# EAGLE schematic SimpleKeyboardTeensy (EAGLE 7.7.0)
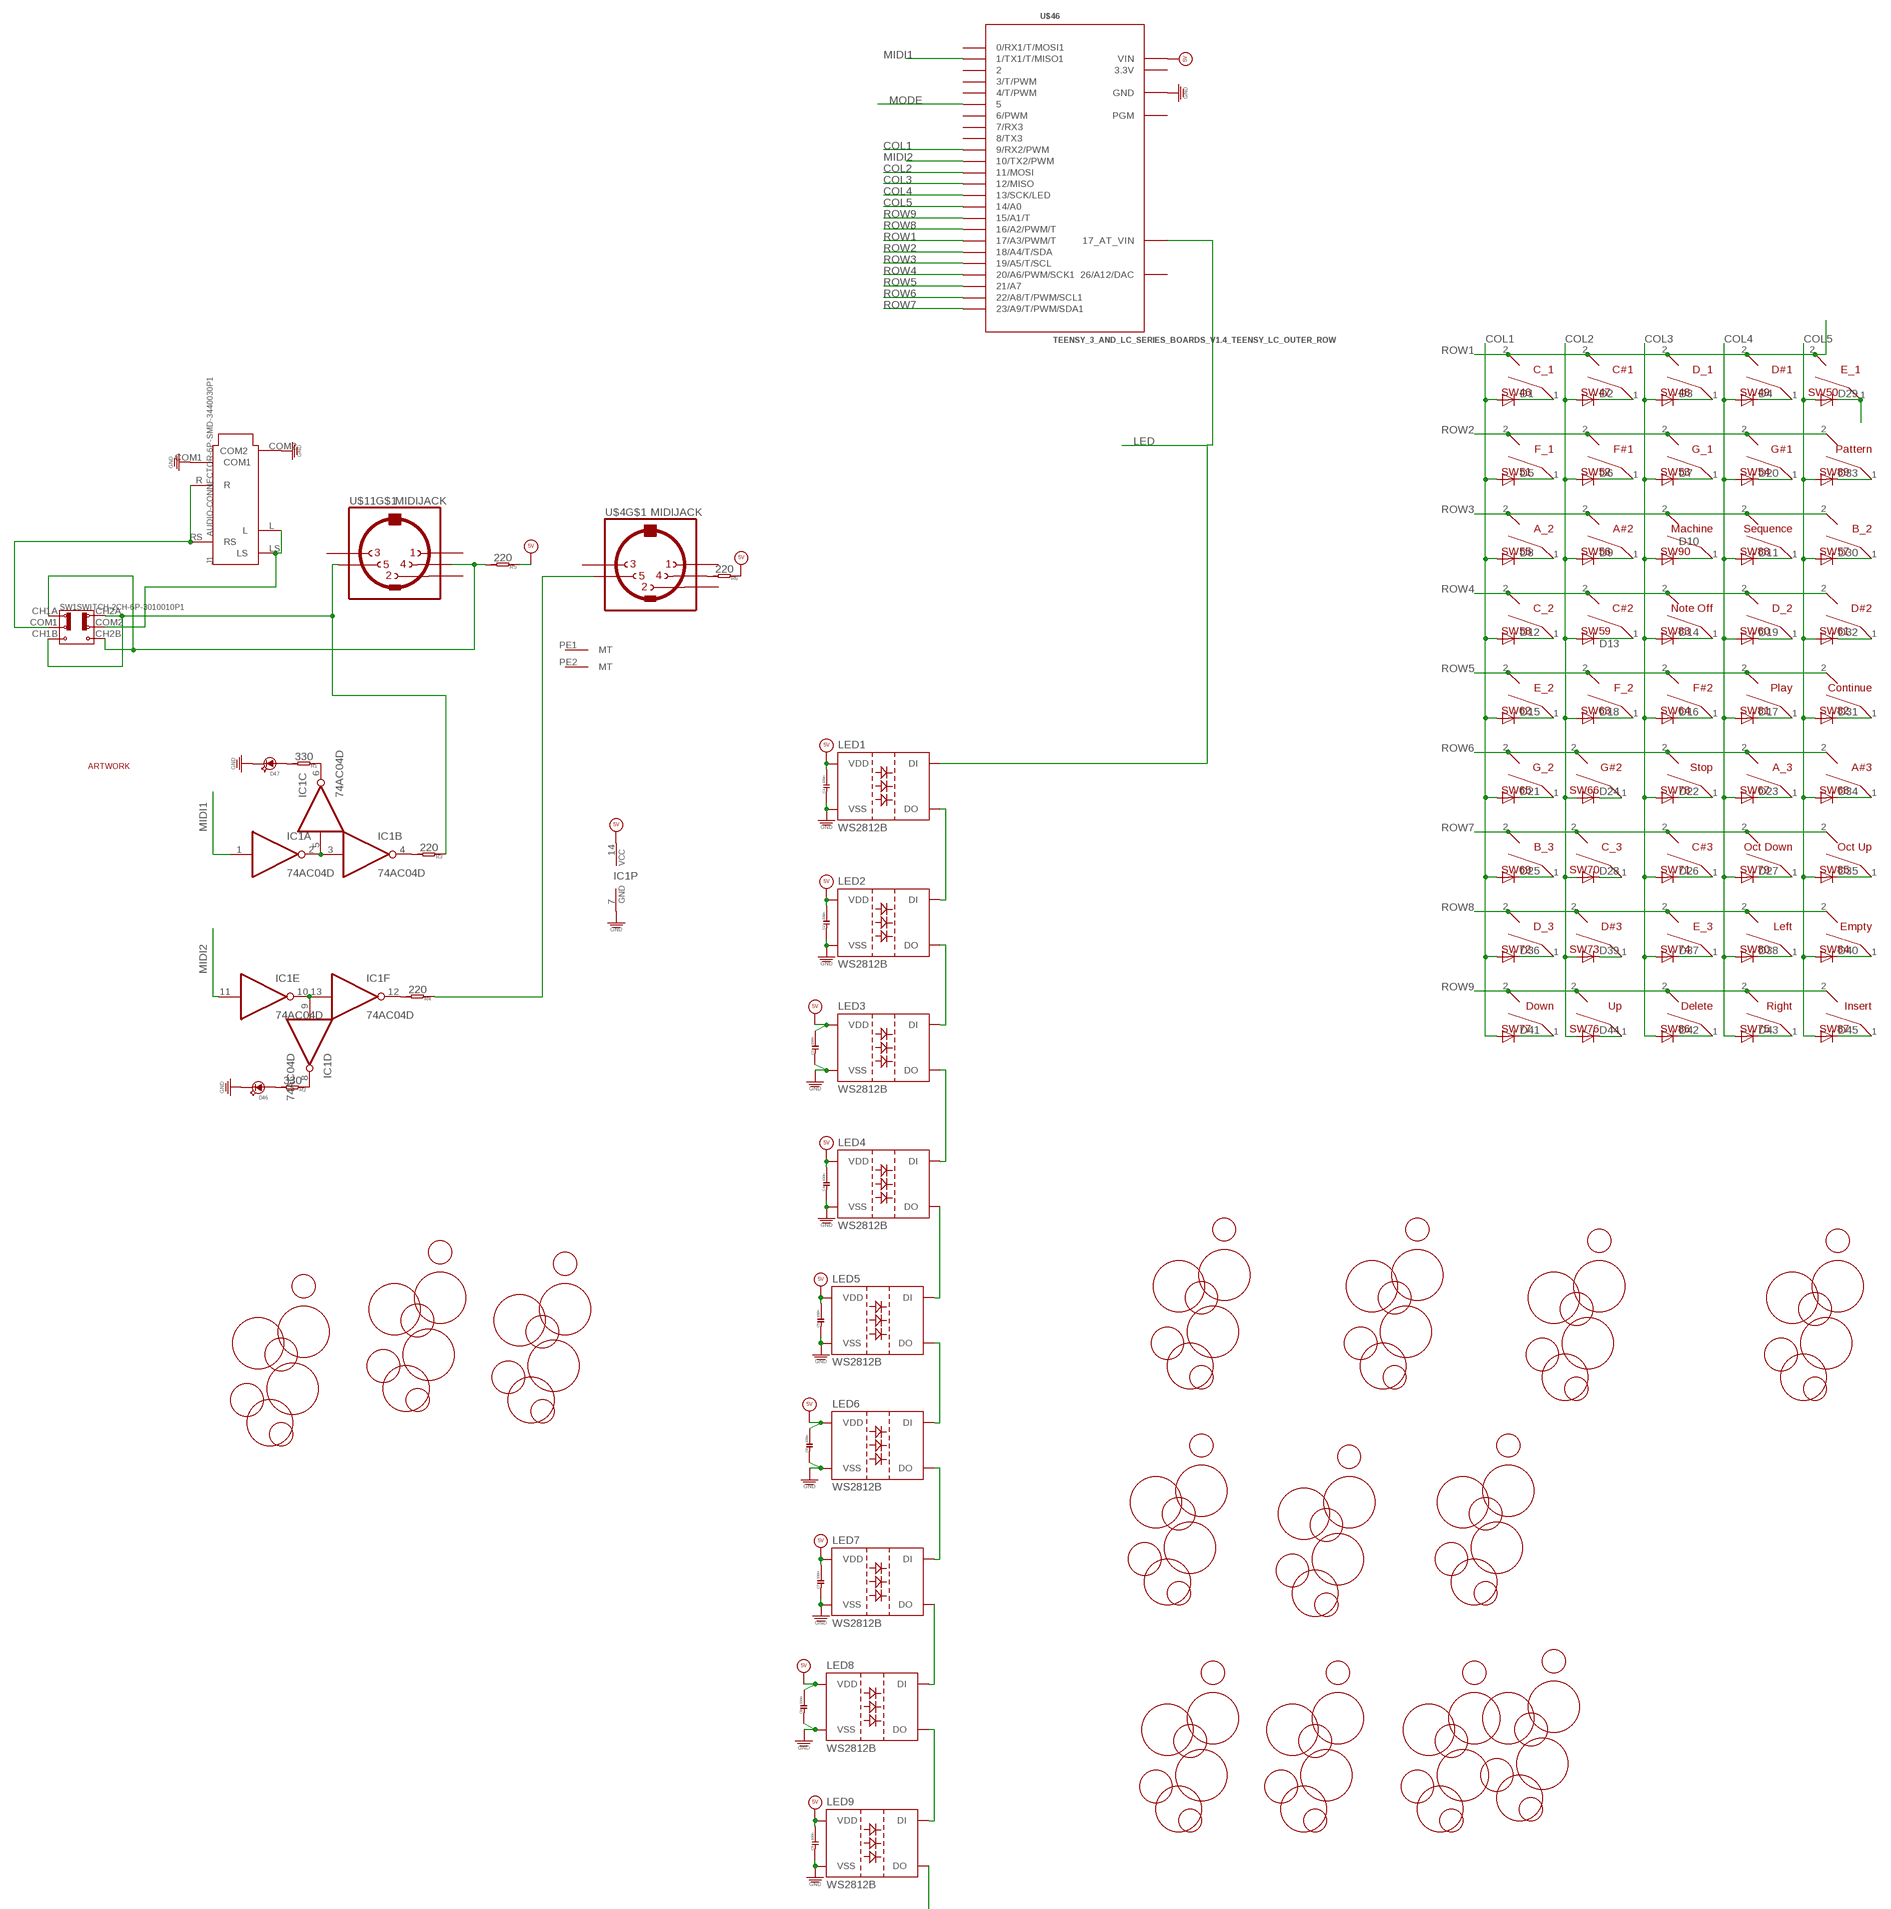
[diagram p0: schematic, sheet 1, part 1 of 3]
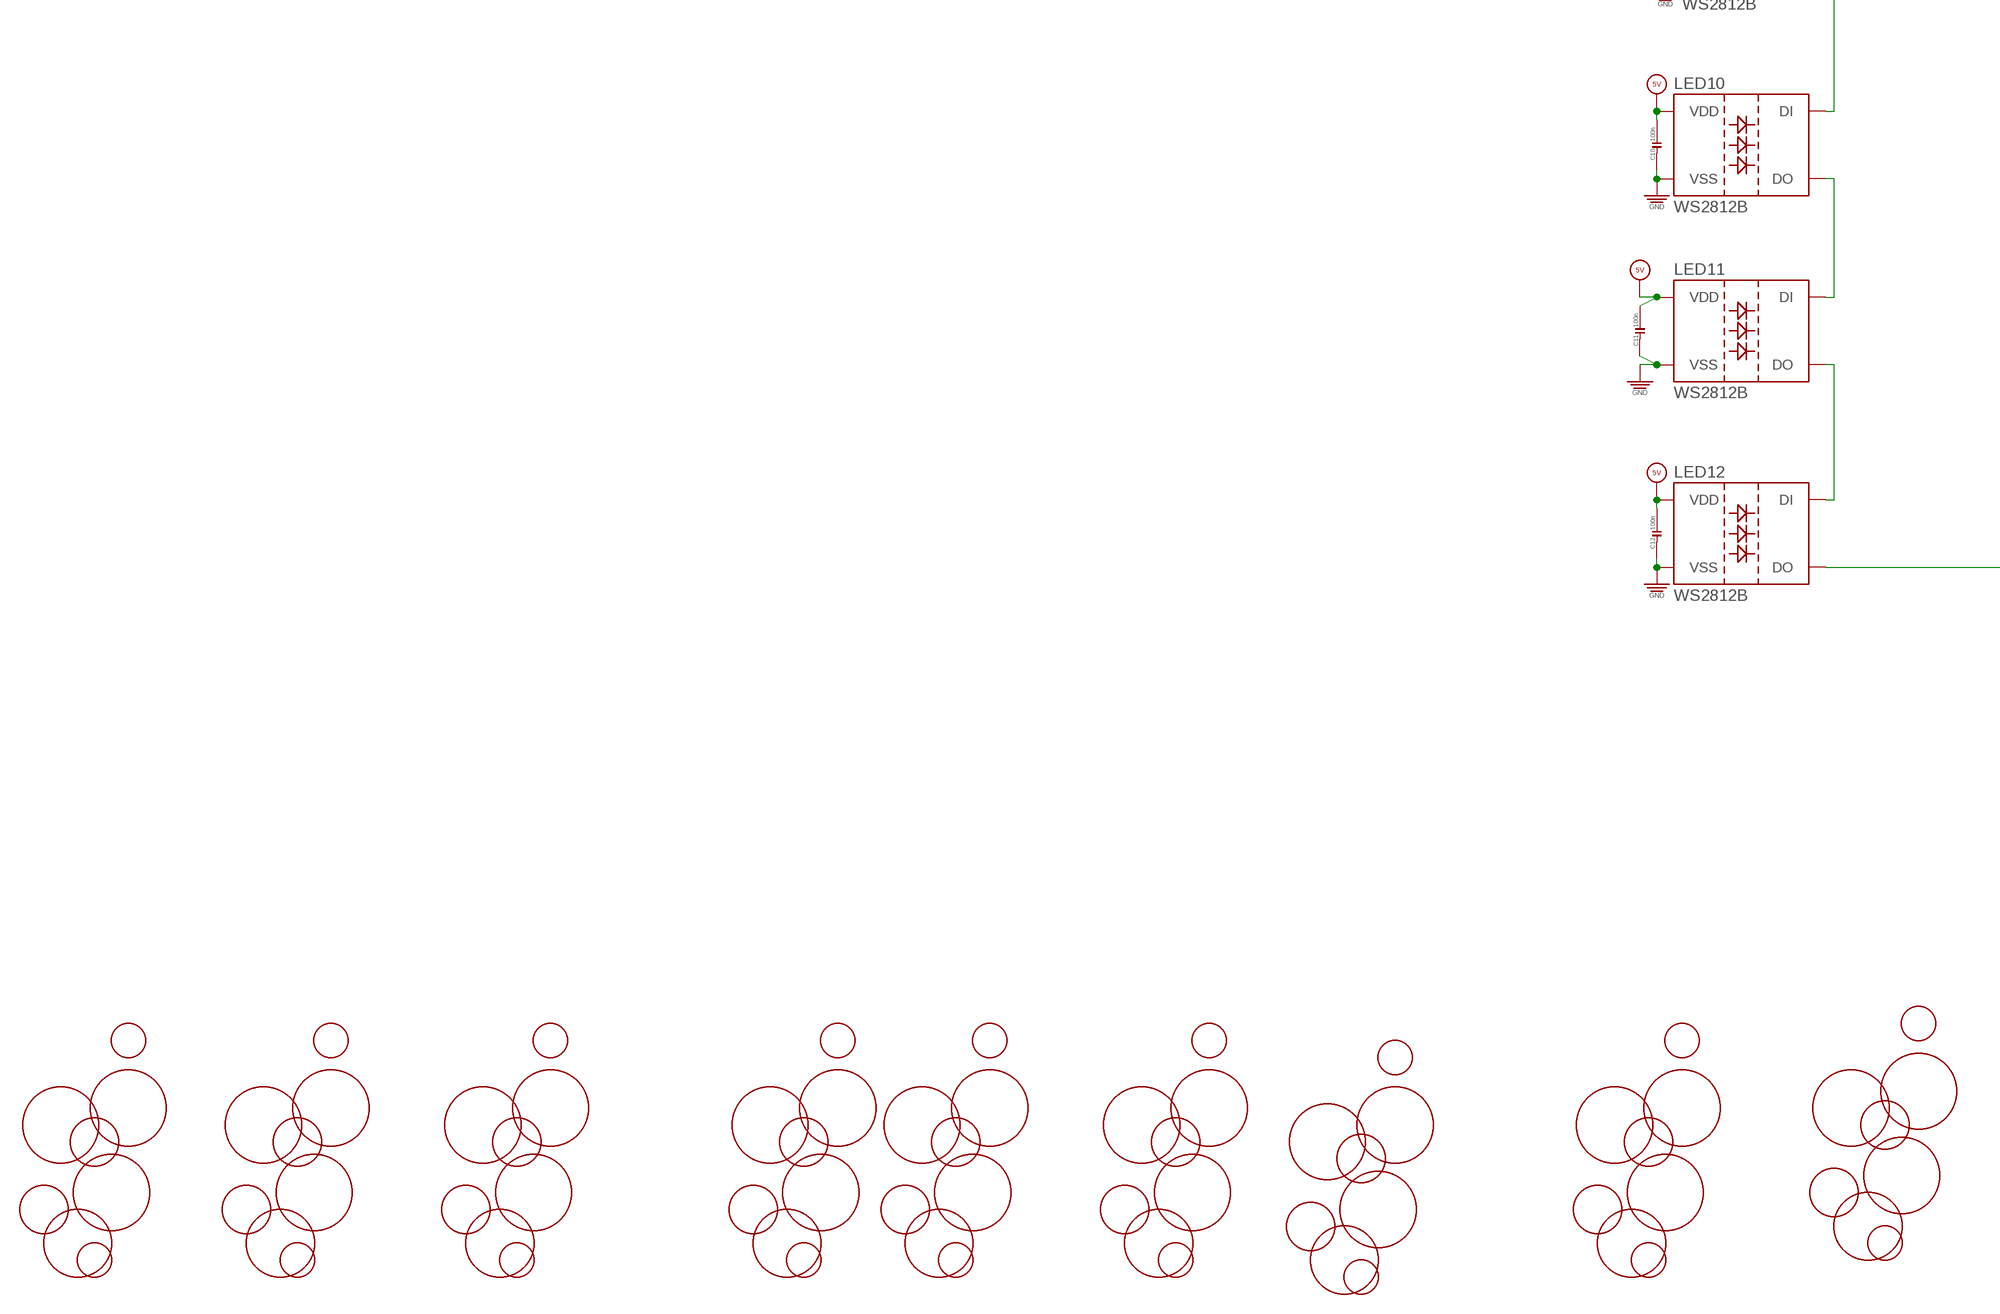
[diagram p1: schematic, sheet 1, part 2 of 3]
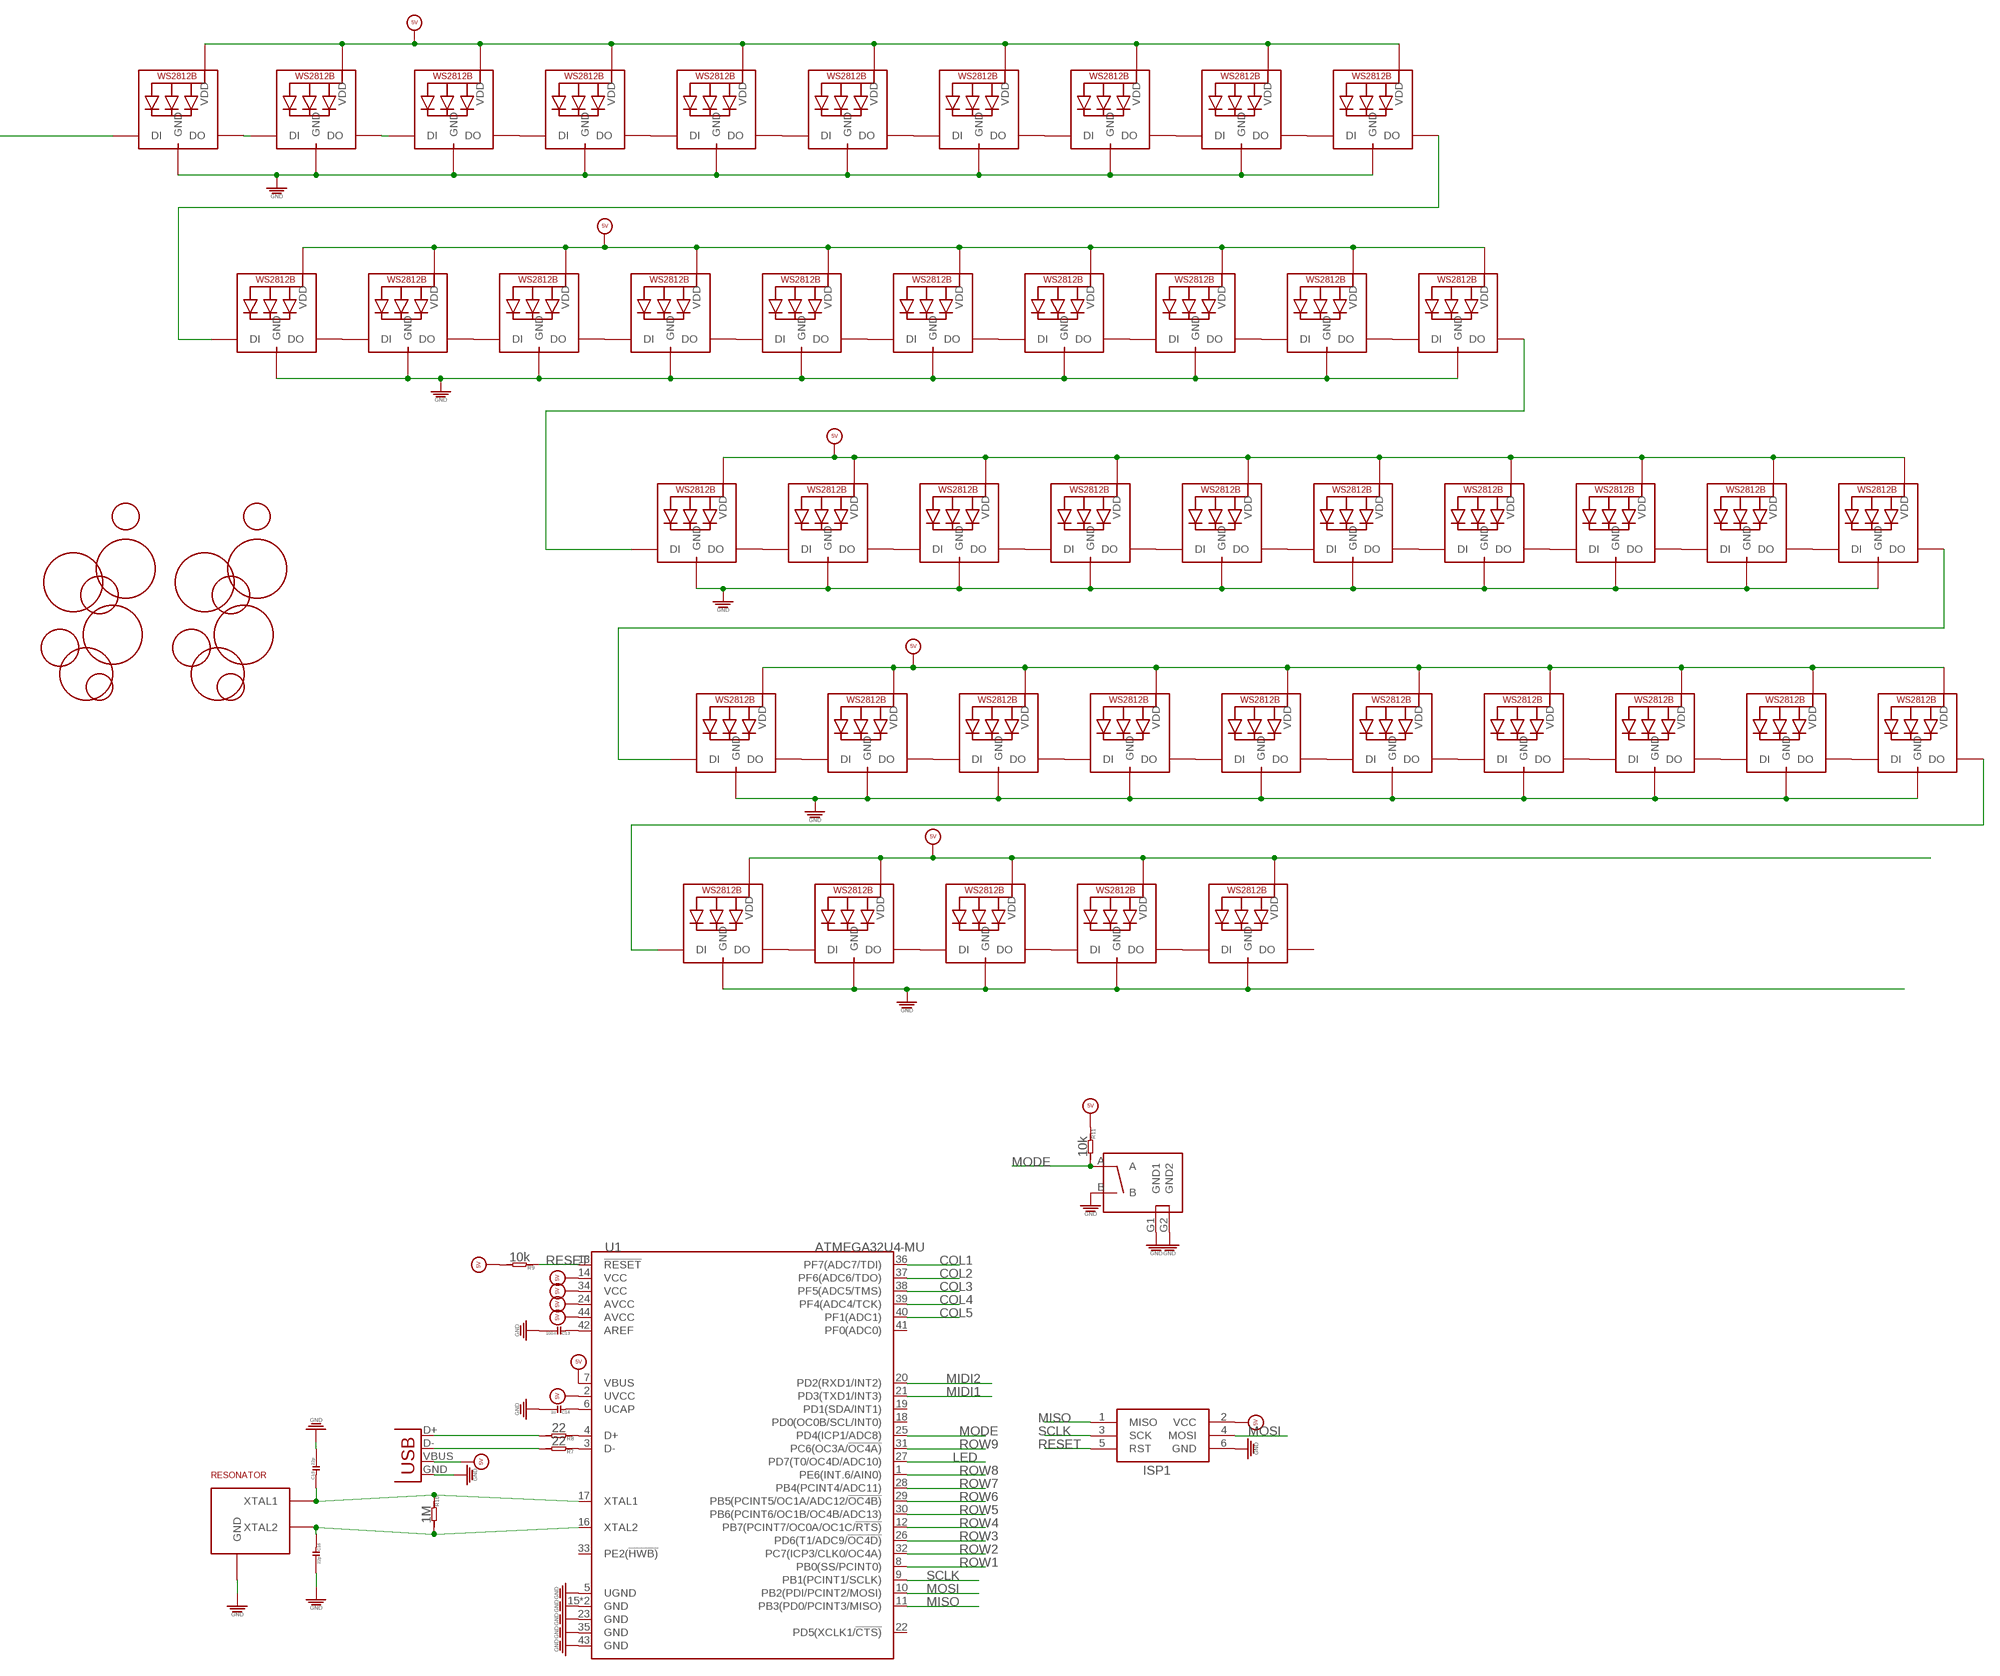
[diagram p2: schematic, sheet 1, part 3 of 3]

## Parts
C1  100n  C-0603  [C0603]
C2  100n  C-0603  [C0603]
C3  100n  C-0603  [C0603]
C4  100n  C-0603  [C0603]
C5  100n  C-0603  [C0603]
C6  100n  C-0603  [C0603]
C7  100n  C-0603  [C0603]
C8  100n  C-0603  [C0603]
C9  100n  C-0603  [C0603]
C10  100n  C-0603  [C0603]
C11  100n  C-0603  [C0603]
C12  100n  C-0603  [C0603]
C13  100n  C-0603  [C0603]
C14  1u  C-0603  [C0603]
C15  22p  C-0603  [C0603]
C16  22p  C-0603  [C0603]
D1  CGRM4001-G  [SOD-123_MINI-SMA]
D2  CGRM4001-G  [SOD-123_MINI-SMA]
D3  CGRM4001-G  [SOD-123_MINI-SMA]
D4  CGRM4001-G  [SOD-123_MINI-SMA]
D5  CGRM4001-G  [SOD-123_MINI-SMA]
D6  CGRM4001-G  [SOD-123_MINI-SMA]
D7  CGRM4001-G  [SOD-123_MINI-SMA]
D8  CGRM4001-G  [SOD-123_MINI-SMA]
D9  CGRM4001-G  [SOD-123_MINI-SMA]
D10  CGRM4001-G  [SOD-123_MINI-SMA]
D11  CGRM4001-G  [SOD-123_MINI-SMA]
D12  CGRM4001-G  [SOD-123_MINI-SMA]
D13  CGRM4001-G  [SOD-123_MINI-SMA]
D14  CGRM4001-G  [SOD-123_MINI-SMA]
D15  CGRM4001-G  [SOD-123_MINI-SMA]
D16  CGRM4001-G  [SOD-123_MINI-SMA]
D17  CGRM4001-G  [SOD-123_MINI-SMA]
D18  CGRM4001-G  [SOD-123_MINI-SMA]
D19  CGRM4001-G  [SOD-123_MINI-SMA]
D20  CGRM4001-G  [SOD-123_MINI-SMA]
D21  CGRM4001-G  [SOD-123_MINI-SMA]
D22  CGRM4001-G  [SOD-123_MINI-SMA]
D23  CGRM4001-G  [SOD-123_MINI-SMA]
D24  CGRM4001-G  [SOD-123_MINI-SMA]
D25  CGRM4001-G  [SOD-123_MINI-SMA]
D26  CGRM4001-G  [SOD-123_MINI-SMA]
D27  CGRM4001-G  [SOD-123_MINI-SMA]
D28  CGRM4001-G  [SOD-123_MINI-SMA]
D29  CGRM4001-G  [SOD-123_MINI-SMA]
D30  CGRM4001-G  [SOD-123_MINI-SMA]
D31  CGRM4001-G  [SOD-123_MINI-SMA]
D32  CGRM4001-G  [SOD-123_MINI-SMA]
D33  CGRM4001-G  [SOD-123_MINI-SMA]
D34  CGRM4001-G  [SOD-123_MINI-SMA]
D35  CGRM4001-G  [SOD-123_MINI-SMA]
D36  CGRM4001-G  [SOD-123_MINI-SMA]
D37  CGRM4001-G  [SOD-123_MINI-SMA]
D38  CGRM4001-G  [SOD-123_MINI-SMA]
D39  CGRM4001-G  [SOD-123_MINI-SMA]
D40  CGRM4001-G  [SOD-123_MINI-SMA]
D41  CGRM4001-G  [SOD-123_MINI-SMA]
D42  CGRM4001-G  [SOD-123_MINI-SMA]
D43  CGRM4001-G  [SOD-123_MINI-SMA]
D44  CGRM4001-G  [SOD-123_MINI-SMA]
D45  CGRM4001-G  [SOD-123_MINI-SMA]
D46  LED3MM  [3MMLED]
D47  LED3MM  [3MMLED]
IC1  74AC04D  [SO14]
ISP1  AVRISP-6  [AVRISP]
J1  AUDIO-CONNECTOR-6P-SMD-3440030P1  [6P-SMD-3.5]
JP1  USB-B  USBPTH  [USB-B-PTH]
LED1  WS2812B  [WS2812B]
LED2  WS2812B  [WS2812B]
LED3  WS2812B  [WS2812B]
LED4  WS2812B  [WS2812B]
LED5  WS2812B  [WS2812B]
LED6  WS2812B  [WS2812B]
LED7  WS2812B  [WS2812B]
LED8  WS2812B  [WS2812B]
LED9  WS2812B  [WS2812B]
LED10  WS2812B  [WS2812B]
LED11  WS2812B  [WS2812B]
LED12  WS2812B  [WS2812B]
LED13  WS2812B3535  [LED3535]
LED14  WS2812B3535  [LED3535]
LED15  WS2812B3535  [LED3535]
LED16  WS2812B3535  [LED3535]
LED17  WS2812B3535  [LED3535]
LED18  WS2812B3535  [LED3535]
LED19  WS2812B3535  [LED3535]
LED20  WS2812B3535  [LED3535]
LED21  WS2812B3535  [LED3535]
LED22  WS2812B3535  [LED3535]
LED23  WS2812B3535  [LED3535]
LED24  WS2812B3535  [LED3535]
LED25  WS2812B3535  [LED3535]
LED26  WS2812B3535  [LED3535]
LED27  WS2812B3535  [LED3535]
LED28  WS2812B3535  [LED3535]
LED29  WS2812B3535  [LED3535]
LED30  WS2812B3535  [LED3535]
LED31  WS2812B3535  [LED3535]
LED32  WS2812B3535  [LED3535]
LED33  WS2812B3535  [LED3535]
LED34  WS2812B3535  [LED3535]
LED35  WS2812B3535  [LED3535]
LED36  WS2812B3535  [LED3535]
LED37  WS2812B3535  [LED3535]
LED38  WS2812B3535  [LED3535]
LED39  WS2812B3535  [LED3535]
LED40  WS2812B3535  [LED3535]
LED41  WS2812B3535  [LED3535]
LED42  WS2812B3535  [LED3535]
LED43  WS2812B3535  [LED3535]
LED44  WS2812B3535  [LED3535]
LED45  WS2812B3535  [LED3535]
LED46  WS2812B3535  [LED3535]
LED47  WS2812B3535  [LED3535]
LED48  WS2812B3535  [LED3535]
LED49  WS2812B3535  [LED3535]
LED50  WS2812B3535  [LED3535]
LED51  WS2812B3535  [LED3535]
LED52  WS2812B3535  [LED3535]
LED53  WS2812B3535  [LED3535]
LED54  WS2812B3535  [LED3535]
LED55  WS2812B3535  [LED3535]
LED56  WS2812B3535  [LED3535]
LED57  WS2812B3535  [LED3535]
R1  330  R-0603  [R0603]
R2  330  R-0603  [R0603]
R3  220  R-0603  [R0603]
R4  220  R-0603  [R0603]
R5  220  R-0603  [R0603]
R6  220  R-0603  [R0603]
R7  22  R-0603  [R0603]
R8  22  R-0603  [R0603]
R9  10k  R-0603  [R0603]
R10  1M  R-0603  [R0603]
R11  10k  R-0603  [R0603]
SW1  SWITCH-2CH-6P-3010010P1  [6P-2CH-2.54-9.1X3.5X3.2+2H]
SW46  C_1  CHERRY_MX_WITH_FIXING_PINS  [MX1A-XXNW]
SW47  C#1  CHERRY_MX_WITH_FIXING_PINS  [MX1A-XXNW]
SW48  D_1  CHERRY_MX_WITH_FIXING_PINS  [MX1A-XXNW]
SW49  D#1  CHERRY_MX_WITH_FIXING_PINS  [MX1A-XXNW]
SW50  E_1  CHERRY_MX_WITH_FIXING_PINS  [MX1A-XXNW]
SW51  F_1  CHERRY_MX_WITH_FIXING_PINS  [MX1A-XXNW]
SW52  F#1  CHERRY_MX_WITH_FIXING_PINS  [MX1A-XXNW]
SW53  G_1  CHERRY_MX_WITH_FIXING_PINS  [MX1A-XXNW]
SW54  G#1  CHERRY_MX_WITH_FIXING_PINS  [MX1A-XXNW]
SW55  A_2  CHERRY_MX_WITH_FIXING_PINS  [MX1A-XXNW]
SW56  A#2  CHERRY_MX_WITH_FIXING_PINS  [MX1A-XXNW]
SW57  B_2  CHERRY_MX_WITH_FIXING_PINS  [MX1A-XXNW]
SW58  C_2  CHERRY_MX_WITH_FIXING_PINS  [MX1A-XXNW]
SW59  C#2  CHERRY_MX_WITH_FIXING_PINS  [MX1A-XXNW]
SW60  D_2  CHERRY_MX_WITH_FIXING_PINS  [MX1A-XXNW]
SW61  D#2  CHERRY_MX_WITH_FIXING_PINS  [MX1A-XXNW]
SW62  E_2  CHERRY_MX_WITH_FIXING_PINS  [MX1A-XXNW]
SW63  F_2  CHERRY_MX_WITH_FIXING_PINS  [MX1A-XXNW]
SW64  F#2  CHERRY_MX_WITH_FIXING_PINS  [MX1A-XXNW]
SW65  G_2  CHERRY_MX_WITH_FIXING_PINS  [MX1A-XXNW]
SW66  G#2  CHERRY_MX_WITH_FIXING_PINS  [MX1A-XXNW]
SW67  A_3  CHERRY_MX_WITH_FIXING_PINS  [MX1A-XXNW]
SW68  A#3  CHERRY_MX_WITH_FIXING_PINS  [MX1A-XXNW]
SW69  B_3  CHERRY_MX_WITH_FIXING_PINS  [MX1A-XXNW]
SW70  C_3  CHERRY_MX_WITH_FIXING_PINS  [MX1A-XXNW]
SW71  C#3  CHERRY_MX_WITH_FIXING_PINS  [MX1A-XXNW]
SW72  D_3  CHERRY_MX_WITH_FIXING_PINS  [MX1A-XXNW]
SW73  D#3  CHERRY_MX_WITH_FIXING_PINS  [MX1A-XXNW]
SW74  E_3  CHERRY_MX_WITH_FIXING_PINS  [MX1A-XXNW]
SW75  Right  CHERRY_MX_WITH_FIXING_PINS  [MX1A-XXNW]
SW76  Up  CHERRY_MX_WITH_FIXING_PINS  [MX1A-XXNW]
SW77  Down  CHERRY_MX_WITH_FIXING_PINS  [MX1A-XXNW]
SW78  Stop  CHERRY_MX_WITH_FIXING_PINS  [MX1A-XXNW]
SW79  Oct Down  CHERRY_MX_WITH_FIXING_PINS  [MX1A-XXNW]
SW80  Left  CHERRY_MX_WITH_FIXING_PINS  [MX1A-XXNW]
SW81  Play  CHERRY_MX_WITH_FIXING_PINS  [MX1A-XXNW]
SW82  Continue  CHERRY_MX_WITH_FIXING_PINS  [MX1A-XXNW]
SW83  Note Off  CHERRY_MX_WITH_FIXING_PINS  [MX1A-XXNW]
SW84  Empty  CHERRY_MX_WITH_FIXING_PINS  [MX1A-XXNW]
SW85  Oct Up  CHERRY_MX_WITH_FIXING_PINS  [MX1A-XXNW]
SW86  Delete  CHERRY_MX_WITH_FIXING_PINS  [MX1A-XXNW]
SW87  Insert  CHERRY_MX_WITH_FIXING_PINS  [MX1A-XXNW]
SW88  Sequence  CHERRY_MX_WITH_FIXING_PINS  [MX1A-XXNW]
SW89  Pattern  CHERRY_MX_WITH_FIXING_PINS  [MX1A-XXNW]
SW90  Machine  CHERRY_MX_WITH_FIXING_PINS  [MX1A-XXNW]
U1  ATMEGA32U4-MU  [QFN44]
U$4  MIDIJACK  [CP-2350]
U$11  MIDIJACK  [CP-2350]
U$15  BUBBLESDSA_1U  [BUBBLES]
U$16  BUBBLESDSA_1U  [BUBBLES]
U$17  BUBBLESDSA_1U  [BUBBLES]
U$18  BUBBLESDSA_1U  [BUBBLES]
U$19  BUBBLESDSA_1U  [BUBBLES]
U$20  BUBBLESDSA_1U  [BUBBLES]
U$21  BUBBLESDSA_1U_HALF  [BUBBLES_HALF]
U$22  BUBBLESDSA_1U_HALF  [BUBBLES_HALF]
U$28  BUBBLESINV  [BUBBLES_INV]
U$29  BUBBLESINV  [BUBBLES_INV]
U$30  BUBBLESINV  [BUBBLES_INV]
U$31  BUBBLESINV  [BUBBLES_INV]
U$32  BUBBLESINV  [BUBBLES_INV]
U$33  BUBBLESDSA_1U_HALF  [BUBBLES_HALF]
U$34  BUBBLESONE  [BUBBLES_ONE]
U$35  BUBBLESONE  [BUBBLES_ONE]
U$36  BUBBLESONE  [BUBBLES_ONE]
U$37  BUBBLESONE  [BUBBLES_ONE]
U$38  BUBBLESONE  [BUBBLES_ONE]
U$39  BUBBLESONE  [BUBBLES_ONE]
U$40  BUBBLESONE  [BUBBLES_ONE]
U$41  BUBBLESONE  [BUBBLES_ONE]
U$42  BUBBLESONE  [BUBBLES_ONE]
U$43  BUBBLESONE  [BUBBLES_ONE]
U$44  BUBBLESONE  [BUBBLES_ONE]
U$46  TEENSY_3_AND_LC_SERIES_BOARDS_V1.4_TEENSY_LC_OUTER_ROW  [TEENSY_3_AND_LC_SERIES_BOARDS_V1.4_TEENSY_3.0-3.2&LC_OUTER_ROW]
U$60  RESONATOR  [16MHZXTAL]
U$61  2PSWITCH_SMT_SIDEMOUNT  [2X4TACT]
U$63  TINRS_ARTWORKTINYDATE  [JUSTATINYROCKET_DATECODE]

## Nets
5V: C1.2 C2.2 C3.2 C4.2 C5.2 C6.2 C7.2 C8.2 C9.2 C10.2 C11.2 C12.2 IC1.14(P:VCC) ISP1.2(VCC) JP1.VBUS LED1.VDD LED2.VDD LED3.VDD LED4.VDD LED5.VDD LED6.VDD LED7.VDD LED8.VDD LED9.VDD LED10.VDD LED11.VDD LED12.VDD LED13.2(VDD) LED14.2(VDD) LED15.2(VDD) LED16.2(VDD) LED17.2(VDD) LED18.2(VDD) LED19.2(VDD) LED20.2(VDD) LED21.2(VDD) LED22.2(VDD) LED23.2(VDD) LED24.2(VDD) LED25.2(VDD) LED26.2(VDD) LED27.2(VDD) LED28.2(VDD) LED29.2(VDD) LED30.2(VDD) LED31.2(VDD) LED32.2(VDD) LED33.2(VDD) LED34.2(VDD) LED35.2(VDD) LED36.2(VDD) LED37.2(VDD) LED38.2(VDD) LED39.2(VDD) LED40.2(VDD) LED41.2(VDD) LED42.2(VDD) LED43.2(VDD) LED44.2(VDD) LED45.2(VDD) LED46.2(VDD) LED47.2(VDD) LED48.2(VDD) LED49.2(VDD) LED50.2(VDD) LED51.2(VDD) LED52.2(VDD) LED53.2(VDD) LED54.2(VDD) LED55.2(VDD) LED56.2(VDD) LED57.2(VDD) R5.1 R6.1 R9.2 R11.1 U1.2(UVCC) U1.7(VBUS) U1.14(VCC) U1.24(AVCC) U1.34(VCC) U1.44(AVCC) U$46.VIN
COL1: D1.A D5.A D8.A D12.A D15.A D21.A D25.A D36.A D41.A U1.36(PF7(ADC7/TDI)) U$46.9(9/RX2/PWM)
COL2: D2.A D6.A D9.A D13.A D18.A D24.A D28.A D39.A D44.A U1.37(PF6(ADC6/TDO)) U$46.11(11/MOSI)
COL3: D3.A D7.A D10.A D14.A D16.A D22.A D26.A D37.A D42.A U1.38(PF5(ADC5/TMS)) U$46.12(12/MISO)
COL4: D4.A D11.A D17.A D19.A D20.A D23.A D27.A D38.A D43.A U1.39(PF4(ADC4/TCK)) U$46.13(13/SCK/LED)
COL5: D29.A D30.A D31.A D32.A D33.A D34.A D35.A D40.A D45.A U1.40(PF1(ADC1)) U$46.14/A0
GND: C1.1 C2.1 C3.1 C4.1 C5.1 C6.1 C7.1 C8.1 C9.1 C10.1 C11.1 C12.1 C13.2 C14.2 C15.2 C16.2 D46.- D47.- IC1.7(P:GND) ISP1.6(GND) J1.COM1 J1.COM2 JP1.GND LED1.VSS LED2.VSS LED3.VSS LED4.VSS LED5.VSS LED6.VSS LED7.VSS LED8.VSS LED9.VSS LED10.VSS LED11.VSS LED12.VSS LED13.4(GND) LED14.4(GND) LED15.4(GND) LED16.4(GND) LED17.4(GND) LED18.4(GND) LED19.4(GND) LED20.4(GND) LED21.4(GND) LED22.4(GND) LED23.4(GND) LED24.4(GND) LED25.4(GND) LED26.4(GND) LED27.4(GND) LED28.4(GND) LED29.4(GND) LED30.4(GND) LED31.4(GND) LED32.4(GND) LED33.4(GND) LED34.4(GND) LED35.4(GND) LED36.4(GND) LED37.4(GND) LED38.4(GND) LED39.4(GND) LED40.4(GND) LED41.4(GND) LED42.4(GND) LED43.4(GND) LED44.4(GND) LED45.4(GND) LED46.4(GND) LED47.4(GND) LED48.4(GND) LED49.4(GND) LED50.4(GND) LED51.4(GND) LED52.4(GND) LED53.4(GND) LED54.4(GND) LED55.4(GND) LED56.4(GND) LED57.4(GND) U1.5(UGND) U1.15(GND) U1.23(GND) U1.35(GND) U1.43(GND) U1.TAB(GND) U$46.AGND(GND) U$46.GND U$46.GND1(GND) U$60.P$2(GND) U$60.P$4(GND) U$61.B U$61.G1(GND1) U$61.G2(GND2)
LED: LED1.DIN(DI) U1.27(PD7(T0/OC4D/ADC10)) U$46.VBAT(17_AT_VIN)
MIDI1: IC1.1(A:I) U1.21(PD3(TXD1/INT3)) U$46.1(1/TX1/T/MISO1)
MIDI2: IC1.11(E:I) U1.20(PD2(RXD1/INT2)) U$46.10(10/TX2/PWM)
MISO: ISP1.1(MISO) U1.11(PB3(PD0/PCINT3/MISO))
MODE: R11.2 U1.25(PD4(ICP1/ADC8)) U$46.5 U$61.A
MOSI: ISP1.4(MOSI) U1.10(PB2(PDI/PCINT2/MOSI))
N$1: D1.C SW46.1
N$2: D2.C SW47.1
N$3: D3.C SW48.1
N$4: D4.C SW49.1
N$5: D5.C SW51.1
N$6: D6.C SW52.1
N$7: D7.C SW53.1
N$8: D8.C SW55.1
N$9: D9.C SW56.1
N$10: D10.C SW90.1
N$11: D11.C SW88.1
N$12: D12.C SW58.1
N$13: D13.C SW59.1
N$14: D14.C SW83.1
N$15: D15.C SW62.1
N$16: D16.C SW64.1
N$17: D17.C SW81.1
N$18: D18.C SW63.1
N$19: D19.C SW60.1
N$20: D20.C SW54.1
N$21: D21.C SW65.1
N$22: D22.C SW78.1
N$23: D23.C SW67.1
N$24: D24.C SW66.1
N$25: D25.C SW69.1
N$26: D26.C SW71.1
N$27: D27.C SW79.1
N$28: D28.C SW70.1
N$29: D29.C SW50.1
N$30: D30.C SW57.1
N$31: D31.C SW82.1
N$32: D32.C SW61.1
N$33: D33.C SW89.1
N$34: D34.C SW68.1
N$35: D35.C SW85.1
N$36: D36.C SW72.1
N$37: D37.C SW74.1
N$38: D38.C SW80.1
N$39: D39.C SW73.1
N$40: D40.C SW84.1
N$41: D41.C SW77.1
N$42: D42.C SW86.1
N$43: D43.C SW75.1
N$44: D44.C SW76.1
N$45: D45.C SW87.1
N$46: D46.+ R2.2
N$47: LED3.DOUT(DO) LED4.DIN(DI)
N$48: LED13.3(DO) LED14.1(DI)
N$49: LED2.DOUT(DO) LED3.DIN(DI)
N$50: LED1.DOUT(DO) LED2.DIN(DI)
N$51: LED8.DOUT(DO) LED9.DIN(DI)
N$52: LED6.DOUT(DO) LED7.DIN(DI)
N$53: LED5.DOUT(DO) LED6.DIN(DI)
N$54: LED4.DOUT(DO) LED5.DIN(DI)
N$55: IC1.2(A:O) IC1.3(B:I) IC1.5(C:I)
N$56: IC1.9(D:I) IC1.10(E:O) IC1.13(F:I)
N$57: IC1.6(C:O) R1.1
N$58: IC1.8(D:O) R2.1
N$59: D47.+ R1.2
N$60: IC1.4(B:O) R3.2
N$61: IC1.12(F:O) R4.2
N$62: R5.2 SW1.CH1A SW1.CH2B U$11.4
N$63: R6.2 U$4.4
N$64: R3.1 SW1.CH1B SW1.CH2A U$11.5
N$65: R4.1 U$4.5
N$66: LED7.DOUT(DO) LED8.DIN(DI)
N$67: LED11.DOUT(DO) LED12.DIN(DI)
N$68: LED10.DOUT(DO) LED11.DIN(DI)
N$69: LED9.DOUT(DO) LED10.DIN(DI)
N$70: LED14.3(DO) LED15.1(DI)
N$71: LED15.3(DO) LED16.1(DI)
N$72: LED16.3(DO) LED17.1(DI)
N$73: LED18.3(DO) LED19.1(DI)
N$74: LED19.3(DO) LED20.1(DI)
N$75: LED20.3(DO) LED21.1(DI)
N$76: LED21.3(DO) LED22.1(DI)
N$77: LED17.3(DO) LED18.1(DI)
N$78: LED27.3(DO) LED28.1(DI)
N$79: LED12.DOUT(DO) LED13.1(DI)
N$80: LED23.3(DO) LED24.1(DI)
N$81: LED24.3(DO) LED25.1(DI)
N$82: LED25.3(DO) LED26.1(DI)
N$83: LED26.3(DO) LED27.1(DI)
N$84: LED28.3(DO) LED29.1(DI)
N$85: LED29.3(DO) LED30.1(DI)
N$86: LED30.3(DO) LED31.1(DI)
N$87: LED31.3(DO) LED32.1(DI)
N$88: LED37.3(DO) LED38.1(DI)
N$89: LED47.3(DO) LED48.1(DI)
N$90: LED22.3(DO) LED23.1(DI)
N$91: LED33.3(DO) LED34.1(DI)
N$92: LED34.3(DO) LED35.1(DI)
N$93: LED35.3(DO) LED36.1(DI)
N$94: LED36.3(DO) LED37.1(DI)
N$95: LED38.3(DO) LED39.1(DI)
N$96: LED39.3(DO) LED40.1(DI)
N$97: LED40.3(DO) LED41.1(DI)
N$98: LED41.3(DO) LED42.1(DI)
N$99: JP1.D- R7.2
N$100: JP1.D+ R8.2
N$101: LED32.3(DO) LED33.1(DI)
N$102: LED43.3(DO) LED44.1(DI)
N$103: LED44.3(DO) LED45.1(DI)
N$104: LED45.3(DO) LED46.1(DI)
N$105: LED46.3(DO) LED47.1(DI)
N$106: LED48.3(DO) LED49.1(DI)
N$107: LED49.3(DO) LED50.1(DI)
N$108: LED50.3(DO) LED51.1(DI)
N$109: LED51.3(DO) LED52.1(DI)
N$110: C13.1 U1.42(AREF)
N$111: R8.1 U1.4(D+)
N$112: LED42.3(DO) LED43.1(DI)
N$113: LED53.3(DO) LED54.1(DI)
N$114: LED54.3(DO) LED55.1(DI)
N$115: LED55.3(DO) LED56.1(DI)
N$116: LED56.3(DO) LED57.1(DI)
N$117: R7.1 U1.3(D-)
N$118: C14.1 U1.6(UCAP)
N$119: C15.1 R10.1 U1.17(XTAL1) U$60.P$1(XTAL1)
N$120: C16.1 R10.2 U1.16(XTAL2) U$60.P$3(XTAL2)
N$121: J1.R J1.RS SW1.COM1
N$122: J1.L J1.LS SW1.COM2
N$123: LED52.3(DO) LED53.1(DI)
RESET: ISP1.5(RST) R9.1 U1.13(!RESET)
ROW1: SW46.2 SW47.2 SW48.2 SW49.2 SW50.2 U1.8(PB0(SS/PCINT0)) U$46.17/A3(17/A3/PWM/T)
ROW2: SW51.2 SW52.2 SW53.2 SW54.2 SW89.2 U1.32(PC7(ICP3/CLK0/OC4A)) U$46.18/A4(18/A4/T/SDA)
ROW3: SW55.2 SW56.2 SW57.2 SW88.2 SW90.2 U1.26(PD6(T1/ADC9/!OC4D)) U$46.19/A5(19/A5/T/SCL)
ROW4: SW58.2 SW59.2 SW60.2 SW61.2 SW83.2 U1.12(PB7(PCINT7/OC0A/OC1C/!RTS)) U$46.20/A6(20/A6/PWM/SCK1)
ROW5: SW62.2 SW63.2 SW64.2 SW81.2 SW82.2 U1.30(PB6(PCINT6/OC1B/OC4B/ADC13)) U$46.21/A7
ROW6: SW65.2 SW66.2 SW67.2 SW68.2 SW78.2 U1.29(PB5(PCINT5/OC1A/ADC12/!OC4B)) U$46.22/A8(22/A8/T/PWM/SCL1)
ROW7: SW69.2 SW70.2 SW71.2 SW79.2 SW85.2 U1.28(PB4(PCINT4/ADC11)) U$46.23/A9(23/A9/T/PWM/SDA1)
ROW8: SW72.2 SW73.2 SW74.2 SW80.2 SW84.2 U1.1(PE6(INT.6/AIN0)) U$46.16/A2(16/A2/PWM/T)
ROW9: SW75.2 SW76.2 SW77.2 SW86.2 SW87.2 U1.31(PC6(OC3A/!OC4A)) U$46.15/A1(15/A1/T)
SCLK: ISP1.3(SCK) U1.9(PB1(PCINT1/SCLK))
Unconnected: LED57.3(DO) U1.18(PD0(OC0B/SCL/INT0)) U1.19(PD1(SDA/INT1)) U1.22(PD5(XCLK1/!CTS)) U1.33(PE2(!HWB)) U1.41(PF0(ADC0)) U$4.1 U$4.2 U$4.3 U$4.PE1(MT) U$4.PE2(MT) U$4.PE(MT) U$4.PE@(MT) U$11.1 U$11.2 U$11.3 U$11.PE1(MT) U$11.PE2(MT) U$11.PE(MT) U$11.PE@(MT) U$46.0(0/RX1/T/MOSI1) U$46.2 U$46.3(3/T/PWM) U$46.4(4/T/PWM) U$46.6(6/PWM) U$46.7(7/RX3) U$46.8(8/TX3) U$46.PGM

## Power pins joined to a net without a drawn wire
3.3V: U$46.3.3V U$46.3.3V1(3.3V)
26/A12/DAC: U$46.RESET/DAC(26/A12/DAC)

## Library data of the parts
C1-C16 = OPL:C*
D1-D45 = diode:CGRM400*-G: Molded plasitc,JEDEC SOD-123/Mini SMA Source: Comchip CGRM4001-G.pdf
D46 D47 = EurorackModularParts:LED*: LED
IC1 = 74xx-eu:74*04: Hex INVERTER
ISP1 = adafruit:AVRISP: AVR ISP HEADER Standard 6 pin header for AVR programming
J1 = OPL:AUDIO-CONNECTOR-6P-SMD
JP1 = SparkFun-Connectors:USB: USB Connectors USB-B-PTH is fully proven SKU : PRT-00139/CONN-08278 USB-miniB is fully proven SKU : PRT-00587 USB-A-PCB is untested. USB-A-H is throughly reviewed, but untested. Spark Fun Electronics SKU : PRT-00437 USB-B-SMT is throughly reviewed, but untested. Needs silkscreen touching up. USB-A-S has not been used/tested USB-MB-H has not been used/tested USB-MICROB has been used. CONN-09505; PROD_ID: CONN-08278
LED1-LED12 = WS2812:WS2812B
LED13-LED57 = EurorackModularParts:WS2812B
R1-R11 = OPL:R*
SW1 = OPL:SWITCH-2CH-6P*: MS-22D18 G2 ROHS
SW46-SW90 = Cherry_MX_v7.0:CHERRY_MX
U1 = IC:ATMEGA32U4: 8-bit Microcontroller With 16/32K Bytes of ISP Flash and USB controller
U$4 U$11 = adafruit:MIDIJACK: DIN 5 jack also known as MIDI jack A modification of conn-hirshman:MAB5SH with two options for the grounding 'teeth'
U$15-U$22 U$28-U$44 = EurorackModularParts:BUBBLES
U$46 = PJB_BRUNO_BALL:TEENSY_3_AND_LC_SERIES_BOARDS_V1.4_TEENSY_LC_OUTER_ROW: Teensy LC with only outer row of pins.
U$60 = EurorackModularParts:RESONATOR
U$61 = zephod-components:2PSWITCH_SMT_SIDEMOUNT
U$63 = EurorackModularParts:TINRS_ARTWORK

## Net classes
0 default: width 0.254 mm
1 power: width 0.381 mm